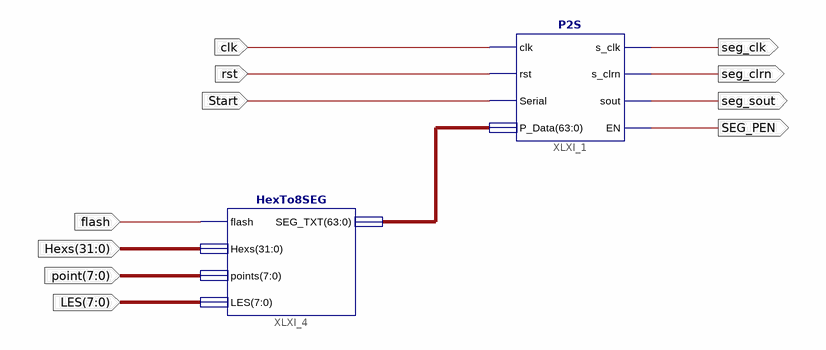
[diagram p0: schematic sheet 1]
// Xilinx ISE schematic Sseg_Dev.sch (kintex7) as structural Verilog: 2 symbols, 11 ports
module Sseg_Dev (
  input  Start,
  input  rst,
  input  clk,
  input  flash,
  input  [31:0] Hexs,
  input  [7:0] point,
  input  [7:0] LES,
  output SEG_PEN,
  output seg_sout,
  output seg_clrn,
  output seg_clk
);

  wire [63:0] XLXN_1;

  P2S XLXI_1 (
    .clk(clk), .rst(rst), .Serial(Start), .P_Data(XLXN_1), .s_clk(seg_clk), .s_clrn(seg_clrn),
    .sout(seg_sout), .EN(SEG_PEN));
  HexTo8SEG XLXI_4 (.flash(flash), .Hexs(Hexs), .points(point), .LES(LES), .SEG_TXT(XLXN_1));
endmodule
